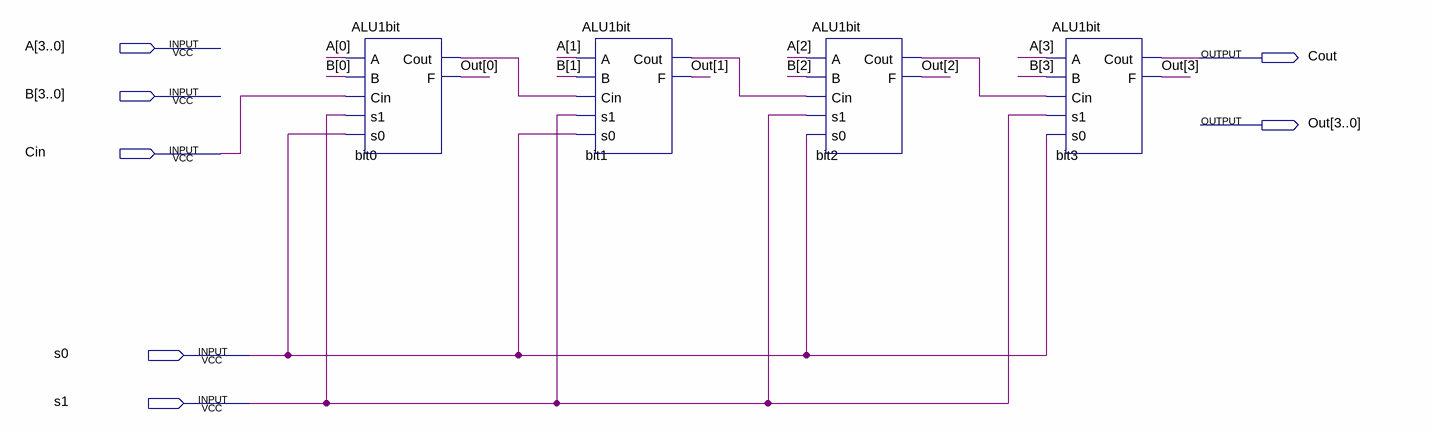
[diagram p0: schematic sheet]
// Quartus schematic ALU4bits.bdf as structural Verilog: 4 symbols, 7 pins
module ALU4bits (
  input  [3:0] A,
  input  [3:0] B,
  input  Cin,
  input  s0,
  input  s1,
  output Cout,
  output [3:0] Out
);

  wire bit0_cout, bit1_cout, bit2_cout;

  ALU1bit bit0 (.A(A[0]), .B(B[0]), .Cin(Cin), .s1(s1), .s0(s0), .Cout(bit0_cout), .F(Out[0]));
  ALU1bit bit1 (.A(A[1]), .B(B[1]), .Cin(bit0_cout), .s1(s1), .s0(s0), .Cout(bit1_cout), .F(Out[1]));
  ALU1bit bit2 (.A(A[2]), .B(B[2]), .Cin(bit1_cout), .s1(s1), .s0(s0), .Cout(bit2_cout), .F(Out[2]));
  ALU1bit bit3 (.A(A[3]), .B(B[3]), .Cin(bit2_cout), .s1(s1), .s0(s0), .Cout(Cout), .F(Out[3]));
endmodule
